# Altium schematic sheet ADDITIONAL.SchDoc
size 381 x 241 mm; SheetNumber: 4; SheetTotal: 4
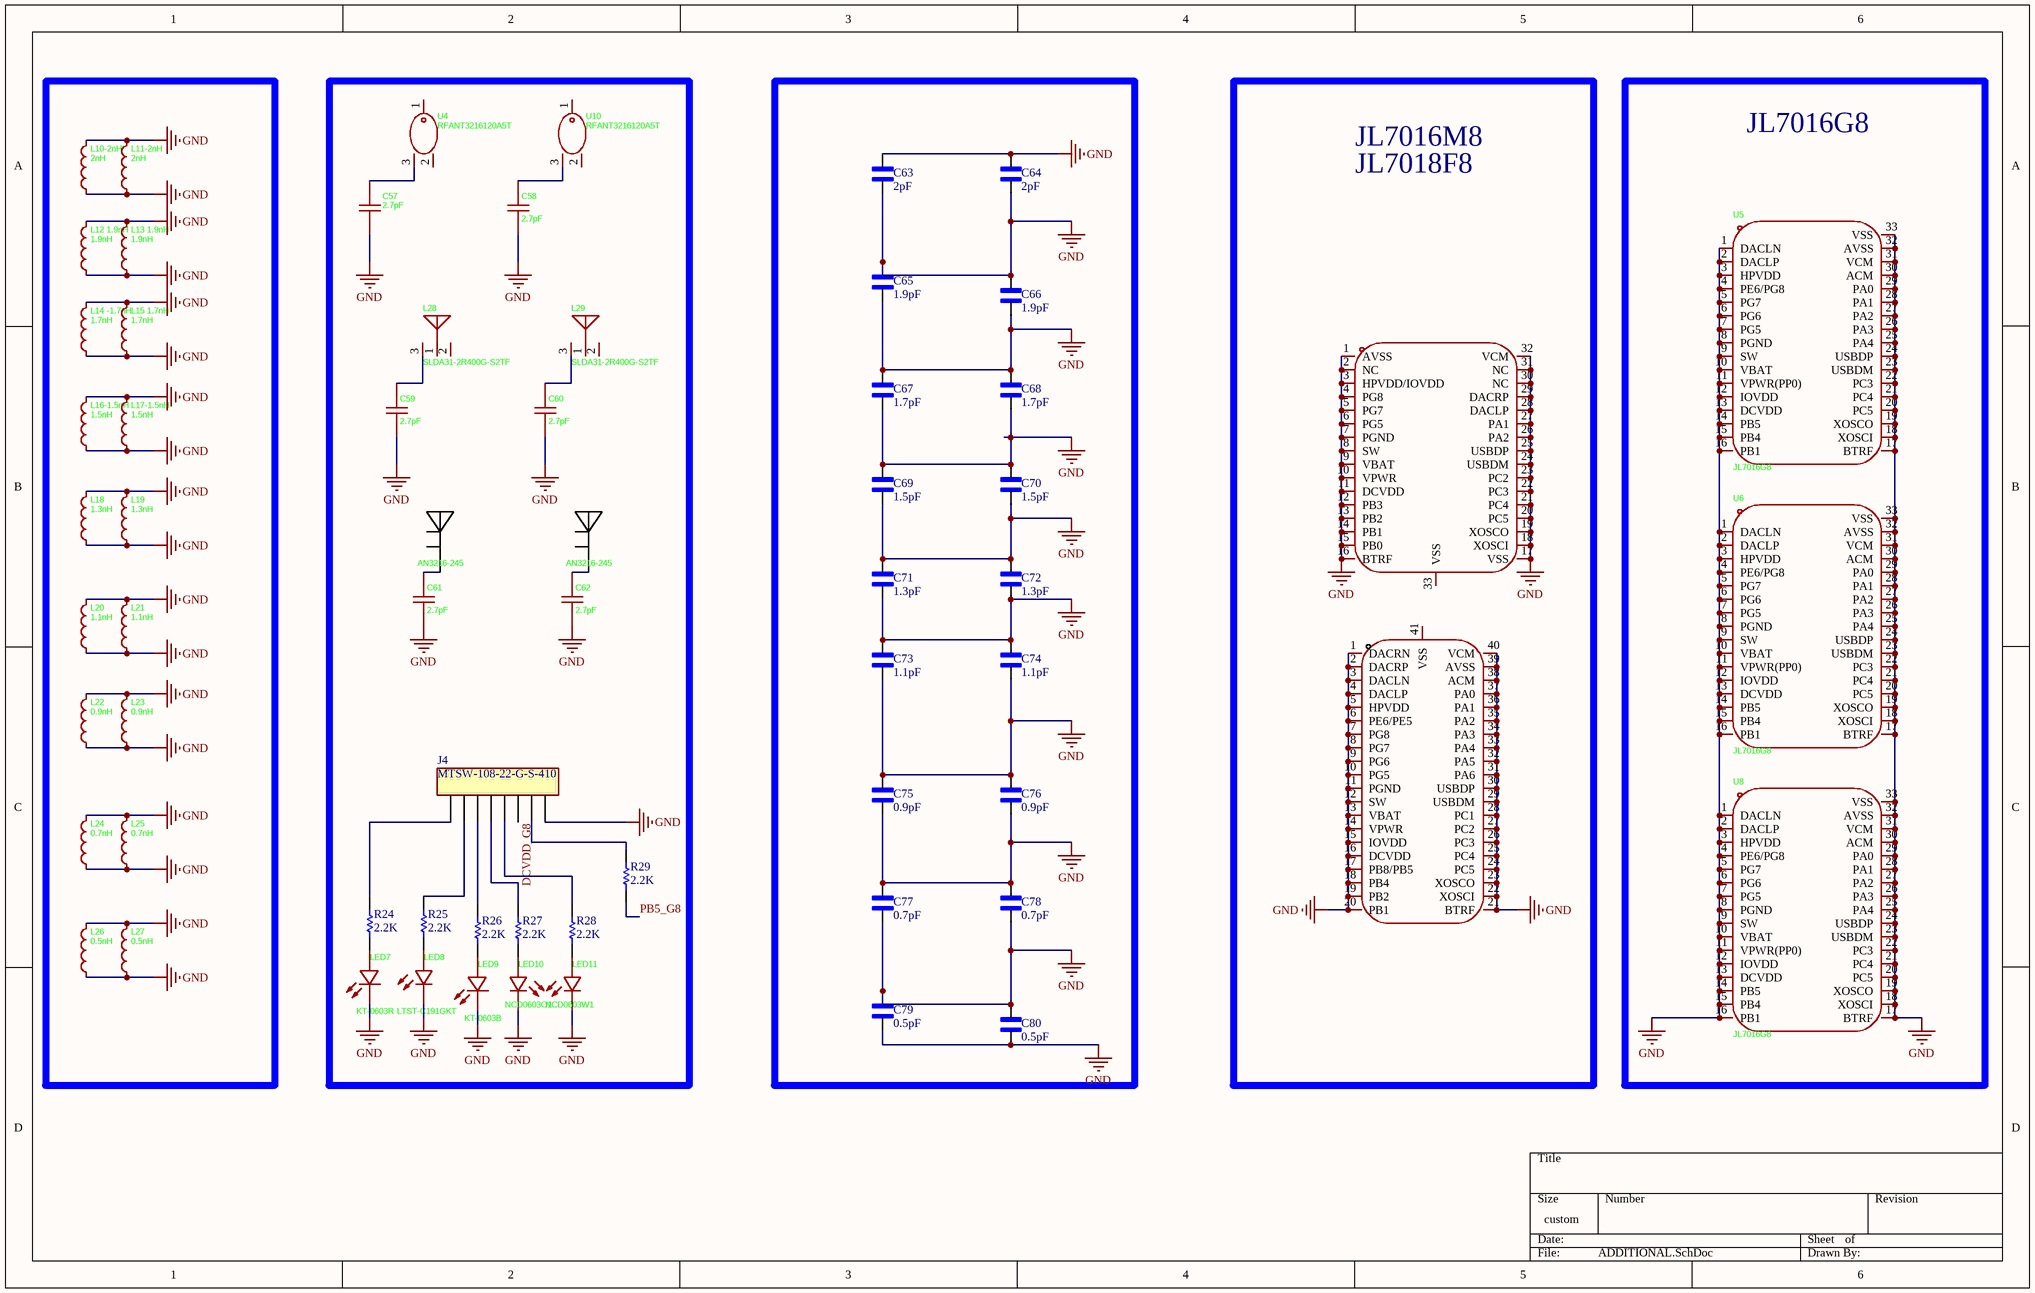
[diagram p0: ADDITIONAL.SchDoc]

## Parts
ANT4  AN3216-245  [CUSTOME ANTEENA]
ANT5  AN3216-245  [CUSTOME ANTEENA]
C57  2.7pF  [C0603]
C58  2.7pF  [C0603]
C59  2.7pF  [C0603]
C60  2.7pF  [C0603]
C61  2.7pF  [C0603]
C62  2.7pF  [C0603]
C63  2pF  [C0402]
C64  2pF  [C0402]
C65  1.9pF  [C0402]
C66  1.9pF  [C0402]
C67  1.7pF  [C0402]
C68  1.7pF  [C0402]
C69  1.5pF  [C0402]
C70  1.5pF  [C0402]
C71  1.3pF  [C0402]
C72  1.3pF  [C0402]
C73  1.1pF  [C0402]
C74  1.1pF  [C0402]
C75  0.9pF  [C0402]
C76  0.9pF  [C0402]
C77  0.7pF  [C0402]
C78  0.7pF  [C0402]
C79  0.5pF  [C0402]
C80  0.5pF  [C0402]
J4  MTSW-108-22-G-S-410  [SAMTEC_MTSW-108-22-G-S-410]
L10-2nH  2nH  [L0603]
L11-2nH  2nH  [L0603]
L12_1.9nH  1.9nH  [L0603]
L13_1.9nH  1.9nH  [L0603]
L14_-1.7nH  1.7nH  [L0603]
L15_1.7nH  1.7nH  [L0603]
L16-1.5nH  1.5nH  [L0603]
L17-1.5nH  1.5nH  [L0603]
L18  1.3nH  [L0603]
L19  1.3nH  [L0603]
L20  1.1nH  [L0603]
L21  1.1nH  [L0603]
L22  0.9nH  [L0603]
L23  0.9nH  [L0603]
L24  0.7nH  [L0603]
L25  0.7nH  [L0603]
L26  0.5nH  [L0603]
L27  0.5nH  [L0603]
L28  SLDA31-2R400G-S2TF  [CUSTOME ANTEENA]
L29  SLDA31-2R400G-S2TF  [CUSTOME ANTEENA]
LED7  KT-0603R  [LED0603-RD]
LED8  LTST-C191GKT  [LED0603-R-RD_GREEN]
LED9  KT-0603B  [LED0603-RD]
LED10  NCD0603O1  [LED0603-RD]
LED11  NCD0603W1  [LED0603-RD]
R24  value 2.2K  [R0603]  (hidden comment: RES_2.2K)
R25  value 2.2K  [R0603]  (hidden comment: RES_2.2K)
R26  value 2.2K  [R0603]  (hidden comment: RES_2.2K)
R27  value 2.2K  [R0603]  (hidden comment: RES_2.2K)
R28  value 2.2K  [R0603]  (hidden comment: RES_2.2K)
R29  value 2.2K  [R0603]  (hidden comment: RES_2.2K)
U4  RFANT3216120A5T  [CUSTOME ANTEENA]
U5  JL7016G8  [QFN-32_L4.0-W4.0-P0.40-TL-EP2.7]
U6  JL7016G8  [QFN-32_L4.0-W4.0-P0.40-TL-EP2.7]
U7  JL7016M8  [QFN-32_L4.0-W4.0-P0.40-TL-EP2.7_1]  (value not drawn)
U8  JL7016G8  [QFN-32_L4.0-W4.0-P0.40-TL-EP2.7]
U9  JL7018F8  [QFN-40_L5.0-W5.0-P0.40-TL-EP3.6]  (value not drawn)
U10  RFANT3216120A5T  [CUSTOME ANTEENA]

## Blocks framed on the sheet
JL7016G8: U5 U6 U8

## Nets
GND: C57.1 C58.1 C59.1 C60.1 C61.1 C62.1 C63.1 C63.2 C64.1 C64.2 C65.1 C65.2 C66.1 C66.2 C67.1 C67.2 C68.1 C68.2 C69.1 C69.2 C70.1 C70.2 C71.1 C71.2 C72.1 C72.2 C73.1 C73.2 C74.1 C74.2 C75.1 C75.2 C76.1 C76.2 C77.1 C77.2 C78.1 C78.2 C79.1 C79.2 C80.1 C80.2 J4.08 L10-2nH.1 L10-2nH.2 L11-2nH.1 L11-2nH.2 L12_1.9nH.1 L12_1.9nH.2 L13_1.9nH.1 L13_1.9nH.2 L14_-1.7nH.1 L14_-1.7nH.2 L15_1.7nH.1 L15_1.7nH.2 L16-1.5nH.1 L16-1.5nH.2 L17-1.5nH.1 L17-1.5nH.2 L18.1 L18.2 L19.1 L19.2 L20.1 L20.2 L21.1 L21.2 L22.1 L22.2 L23.1 L23.2 L24.1 L24.2 L25.1 L25.2 L26.1 L26.2 L27.1 L27.2 LED7.1(K) LED8.2(C) LED9.1(K) LED10.1(K) LED11.1(-) U5.1(DACLN) U5.2(DACLP) U5.3(HPVDD) U5.4(PE6/PG8) U5.5(PG7) U5.6(PG6) U5.7(PG5) U5.8(PGND) U5.9(SW) U5.10(VBAT) U5.11(VPWR(PP0)) U5.12(IOVDD) U5.13(DCVDD) U5.14(PB5) U5.15(PB4) U5.16(PB1) U5.17(BTRF) U5.18(XOSCI) U5.19(XOSCO) U5.20(PC5) U5.21(PC4) U5.22(PC3) U5.23(USBDM) U5.24(USBDP) U5.25(PA4) U5.26(PA3) U5.27(PA2) U5.28(PA1) U5.29(PA0) U5.30(ACM) U5.31(VCM) U5.32(AVSS) U5.33(VSS) U6.1(DACLN) U6.2(DACLP) U6.3(HPVDD) U6.4(PE6/PG8) U6.5(PG7) U6.6(PG6) U6.7(PG5) U6.8(PGND) U6.9(SW) U6.10(VBAT) U6.11(VPWR(PP0)) U6.12(IOVDD) U6.13(DCVDD) U6.14(PB5) U6.15(PB4) U6.16(PB1) U6.17(BTRF) U6.18(XOSCI) U6.19(XOSCO) U6.20(PC5) U6.21(PC4) U6.22(PC3) U6.23(USBDM) U6.24(USBDP) U6.25(PA4) U6.26(PA3) U6.27(PA2) U6.28(PA1) U6.29(PA0) U6.30(ACM) U6.31(VCM) U6.32(AVSS) U6.33(VSS) U7.1(AVSS) U7.2(NC) U7.3(HPVDD/IOVDD) U7.4(PG8) U7.5(PG7) U7.6(PG5) U7.7(PGND) U7.8(SW) U7.9(VBAT) U7.10(VPWR) U7.11(DCVDD) U7.12(PB3) U7.13(PB2) U7.14(PB1) U7.15(PB0) U7.16(BTRF) U7.17(VSS) U7.18(XOSCI) U7.19(XOSCO) U7.20(PC5) U7.21(PC4) U7.22(PC3) U7.23(PC2) U7.24(USBDM) U7.25(USBDP) U7.26(PA2) U7.27(PA1) U7.28(DACLP) U7.29(DACRP) U7.30(NC) U7.31(NC) U7.32(VCM) U8.1(DACLN) U8.2(DACLP) U8.3(HPVDD) U8.4(PE6/PG8) U8.5(PG7) U8.6(PG6) U8.7(PG5) U8.8(PGND) U8.9(SW) U8.10(VBAT) U8.11(VPWR(PP0)) U8.12(IOVDD) U8.13(DCVDD) U8.14(PB5) U8.15(PB4) U8.16(PB1) U8.17(BTRF) U8.18(XOSCI) U8.19(XOSCO) U8.20(PC5) U8.21(PC4) U8.22(PC3) U8.23(USBDM) U8.24(USBDP) U8.25(PA4) U8.26(PA3) U8.27(PA2) U8.28(PA1) U8.29(PA0) U8.30(ACM) U8.31(VCM) U8.32(AVSS) U8.33(VSS) U9.1(DACRN) U9.2(DACRP) U9.3(DACLN) U9.4(DACLP) U9.5(HPVDD) U9.6(PE6/PE5) U9.7(PG8) U9.8(PG7) U9.9(PG6) U9.10(PG5) U9.11(PGND) U9.12(SW) U9.13(VBAT) U9.14(VPWR) U9.15(IOVDD) U9.16(DCVDD) U9.17(PB8/PB5) U9.18(PB4) U9.19(PB2) U9.20(PB1) U9.21(BTRF) U9.22(XOSCI) U9.23(XOSCO) U9.24(PC5) U9.25(PC4) U9.26(PC3) U9.27(PC2) U9.28(PC1) U9.29(USBDM) U9.30(USBDP) U9.31(PA6) U9.32(PA5) U9.33(PA4) U9.34(PA3) U9.35(PA2) U9.36(PA1) U9.37(PA0) U9.38(ACM) U9.39(AVSS) U9.40(VCM)
DCVDD_G8: J4.06
PB5_G8: R29.1
NetANT4_3: ANT4.3 C61.2
NetANT5_3: ANT5.3 C62.2
NetC57_2: C57.2 U4.3
NetC58_2: C58.2 U10.3
NetC59_2: C59.2 L28.3
NetC60_2: C60.2 L29.3
NetJ4_01: J4.01 R24.2
NetJ4_02: J4.02 R25.2
NetJ4_03: J4.03 R26.2
NetJ4_04: J4.04 R27.2
NetJ4_05: J4.05 R28.2
NetJ4_07: J4.07 R29.2
NetLED7_2: LED7.2(A) R24.1
NetLED8_1: LED8.1(A) R25.1
NetLED9_2: LED9.2(A) R26.1
NetLED10_2: LED10.2(A) R27.1
NetLED11_2: LED11.2(+) R28.1

Not connected (* = marked no-connect by the designer): ANT4 1 2; ANT5 1 2; L28 1 2(NC); L29 1 2(NC); U4 1 2; U7 33(VSS); U9 41(VSS); U10 1 2

## Notes on the sheet
- JL7016M8
- JL7018F8

## Library data of the parts
ANT4 ANT5 = AN3216-245: Manufacturer: Rainsun(霖昱微); Add into BOM: yes; Frequency(Center/Band): 2.45GHz; Bandwidth: 100MHz; Peak Gain: 0.5dBi; Impedance: 50Ω; Power: 1W; VSWR: 2.5; Symbol: AN3216-245; Device: AN3216-245; LCSC Part Name: AN3216-245; Supplier Part: C2916136; Manufacturer Part: AN3216-245; Supplier Footprint: 1206; JLCPCB Part Class: Extended Part; Datasheet: https://item.szlcsc.com/datasheet/AN3216-245/3211390.html; Supplier: LCSC; Convert to PCB: yes; Operating Temperature: -40℃~+85℃; Length: 3.2mm; Width: 1.6mm; Height: 1.3mm
C57-C62 = 0603CG2R7C500NT: Manufacturer: FH(风华); Add into BOM: yes; Voltage Rating: 50V; Temperature Coefficient: C0G; Symbol: 0603CG2R7C500NT; Device: 0603CG2R7C500NT; LCSC Part Name: ±0.25pF 2.7pF 50V; Supplier Part: C95180; Manufacturer Part: 0603CG2R7C500NT; Supplier Footprint: 0603; JLCPCB Part Class: Extended Part; Datasheet: https://item.szlcsc.com/datasheet/0603CG2R7C500NT/96381.html; Supplier: LCSC; Convert to PCB: yes; Value: 2.7pF
C63 C64 = CAP 2pF: 2pF 50V C0G 0402 Multilayer Ceramic Capacitors MLCC - SMD/SMT ROHS; Manufacturer: Murata Electronics; MFR.Part #: GJM1555C1H2R0WB01D; JLCPCB Part #: C88885; Package: 0402; Value: 2pF
C65 C66 = CAP 1.9pF: 1.9pF 50V C0G 0402 Multilayer Ceramic Capacitors MLCC - SMD/SMT ROHS; Manufacturer: Murata Electronics; MFR.Part #: GJM1555C1H1R9BB01D; JLCPCB Part #: C161314; Package: 0402; Value: 1.9pF
C67 C68 = CAP 1.7pF: 1.7pF 50V C0G 0402 Multilayer Ceramic Capacitors MLCC - SMD/SMT ROHS; Manufacturer: Murata Electronics; MFR.Part #: GJM1555C1H1R7WB01D; JLCPCB Part #: C471379; Package: 0402; Value: 1.7pF
C69 C70 = CAP 1.5pF: 1.5pF 50V C0G 0402 Multilayer Ceramic Capacitors MLCC - SMD/SMT ROHS; Manufacturer: Murata Electronics; MFR.Part #: GJM1555C1H1R5BB01D; JLCPCB Part #: C76900; Package: 0402; Value: 1.5pF
C71 C72 = CAP 1.3pF: 1.3pF 50V C0G 0402 Multilayer Ceramic Capacitors MLCC - SMD/SMT ROHS; Manufacturer: Murata Electronics; MFR.Part #: GJM1555C1H1R3WB01D; JLCPCB Part #: C88880; Package: 0402; Value: 1.3pF
C73 C74 = CAP 1.1pF: 1.1pF 50V C0G 0402 Multilayer Ceramic Capacitors MLCC - SMD/SMT ROHS; Manufacturer: Murata Electronics; MFR.Part #: GJM1555C1H1R1WB01D; JLCPCB Part #: C88879; Package: 0402; Value: 1.1pF
C75 C76 = CAP 0.9pF: 0.9pF 50V C0G 0402 Multilayer Ceramic Capacitors MLCC - SMD/SMT ROHS; Manufacturer: FH (Guangdong Fenghua Advanced Tech); MFR.Part #: 0402CG0R9B500NT; JLCPCB Part #: C6563238; Package: 0402; Value: 0.9pF
C77 C78 = CAP 0.7pF: 0.7pF 50V C0G 0402 Multilayer Ceramic Capacitors MLCC - SMD/SMT ROHS; Manufacturer: FH (Guangdong Fenghua Advanced Tech); MFR.Part #: 0402CG0R7C500NT; JLCPCB Part #: C284999; Package: 0402; Value: 0.7pF
C79 C80 = CAP 0.5pF: 0.5pF 50V C0G 0402 Multilayer Ceramic Capacitors MLCC - SMD/SMT ROHS; Manufacturer: FH (Guangdong Fenghua Advanced Tech); MFR.Part #: 0402CG0R5C500NT; JLCPCB Part #: C1544; Package: 0402; Value: 0.5pF
L10-2nH L11-2nH = 2nH: 2nH Multilayer inductor 0603 Inductors (SMD) ROHS; Manufacturer: Murata Electronics; Manufacturer Part: SDCL1608C2N0STDF; Symbol: DFE18SAN1R0ME0L; Add into BOM: yes; Tolerance: ±20%; Current Rating: 1.6A; DC Resistance(DCR): 144mΩ; Device: DFE18SAN1R0ME0L; LCSC Part Name: 1uH ±20%; Supplier Part: C370234; Supplier Footprint: 0603; JLCPCB Part Class: Extended Part; Datasheet: https://atta.szlcsc.com/upload/public/pdf/source/20210601/1EEB72040C737E24AB5C3900F417DA4B.pdf; Supplier: LCSC; Convert to PCB: yes; Value: 2nH; Current - Saturation (Isat): -; Q @ Frequency: -; Frequency - Self Resonant: -; Ratings: -
L12_1.9nH L13_1.9nH = 1.9nH: 1.04A 1.9nH 11.3MHz 16@250MHz 70mΩ 0402 Inductors (SMD) ROHS; Manufacturer: Chilisin Elec; Manufacturer Part: CS0402-1N9B-S; Symbol: DFE18SAN1R0ME0L; Add into BOM: yes; Tolerance: ±20%; Current Rating: 1.6A; DC Resistance(DCR): 144mΩ; Device: DFE18SAN1R0ME0L; LCSC Part Name: 1uH ±20%; Supplier Part: C142187; Supplier Footprint: 0603; JLCPCB Part Class: Extended Part; Datasheet: https://atta.szlcsc.com/upload/public/pdf/source/20210601/1EEB72040C737E24AB5C3900F417DA4B.pdf; Supplier: LCSC; Convert to PCB: yes; Value: 1.9nH; Current - Saturation (Isat): -; Q @ Frequency: -; Frequency - Self Resonant: -; Ratings: -
L14_-1.7nH L15_1.7nH = 1.7nH: 1.7nH 100mΩ 640mA 0402 Inductors (SMD) ROHS; Manufacturer: Sunlord; Manufacturer Part: MWSD1005C1N7STM01; Symbol: DFE18SAN1R0ME0L; Add into BOM: yes; Tolerance: ±20%; Current Rating: 1.6A; DC Resistance(DCR): 144mΩ; Device: DFE18SAN1R0ME0L; LCSC Part Name: 1uH ±20%; Supplier Part: C778761; Supplier Footprint: 0603; JLCPCB Part Class: Extended Part; Datasheet: https://atta.szlcsc.com/upload/public/pdf/source/20210601/1EEB72040C737E24AB5C3900F417DA4B.pdf; Supplier: LCSC; Convert to PCB: yes; Value: 1.7nH; Current - Saturation (Isat): -; Q @ Frequency: -; Frequency - Self Resonant: -; Ratings: -
L16-1.5nH L17-1.5nH = 1.5nH: 1.5nH 100mΩ 500mA 6GHz 8@100MHz Multilayer inductor 0603 Inductors (SMD) ROHS; Manufacturer: Sunlord; Manufacturer Part: SDCL1608C1N5STDF; Symbol: DFE18SAN1R0ME0L; Add into BOM: yes; Tolerance: ±20%; Current Rating: 1.6A; DC Resistance(DCR): 144mΩ; Device: DFE18SAN1R0ME0L; LCSC Part Name: 1uH ±20%; Supplier Part: C22223; Supplier Footprint: 0603; JLCPCB Part Class: Extended Part; Datasheet: https://atta.szlcsc.com/upload/public/pdf/source/20210601/1EEB72040C737E24AB5C3900F417DA4B.pdf; Supplier: LCSC; Convert to PCB: yes; Value: 1.5nH; Current - Saturation (Isat): -; Q @ Frequency: -; Frequency - Self Resonant: -; Ratings: -
L18 L19 = 1.3nH: 1.3nH 1A 40mΩ 7@100MHz 8GHz Multilayer inductor 0402 Inductors (SMD) ROHS; Manufacturer: TDK; Manufacturer Part: MLG1005S1N3BT000; Symbol: DFE18SAN1R0ME0L; Add into BOM: yes; Tolerance: ±20%; Current Rating: 1.6A; DC Resistance(DCR): 144mΩ; Device: DFE18SAN1R0ME0L; LCSC Part Name: 1uH ±20%; Supplier Part: C76767; Supplier Footprint: 0603; JLCPCB Part Class: Extended Part; Datasheet: https://atta.szlcsc.com/upload/public/pdf/source/20210601/1EEB72040C737E24AB5C3900F417DA4B.pdf; Supplier: LCSC; Convert to PCB: yes; Value: 1.3nH; Current - Saturation (Isat): -; Q @ Frequency: -; Frequency - Self Resonant: -; Ratings: -
L20 L21 = 1.1nH: 1.1nH 10GHz 1A 30mΩ 7@100MHz AEC-Q200 Multilayer inductor 0402 Inductors (SMD) ROHS; Manufacturer: TDK; Manufacturer Part: MLG1005S1N1BTD25; Symbol: DFE18SAN1R0ME0L; Add into BOM: yes; Tolerance: ±20%; Current Rating: 1.6A; DC Resistance(DCR): 144mΩ; Device: DFE18SAN1R0ME0L; LCSC Part Name: 1uH ±20%; Supplier Part: C404613; Supplier Footprint: 0603; JLCPCB Part Class: Extended Part; Datasheet: https://atta.szlcsc.com/upload/public/pdf/source/20210601/1EEB72040C737E24AB5C3900F417DA4B.pdf; Supplier: LCSC; Convert to PCB: yes; Value: 1.1nH; Current - Saturation (Isat): -; Q @ Frequency: -; Frequency - Self Resonant: -; Ratings: -
L22 L23 = 0.9nH: 0.9nH 100mΩ 10GHz 1A Multilayer inductor 0402 Inductors (SMD) ROHS; Manufacturer: TDK; Manufacturer Part: MLG1005S0N9BT000; Symbol: DFE18SAN1R0ME0L; Add into BOM: yes; Tolerance: ±20%; Current Rating: 1.6A; DC Resistance(DCR): 144mΩ; Device: DFE18SAN1R0ME0L; LCSC Part Name: 1uH ±20%; Supplier Part: C275263; Supplier Footprint: 0603; JLCPCB Part Class: Extended Part; Datasheet: https://atta.szlcsc.com/upload/public/pdf/source/20210601/1EEB72040C737E24AB5C3900F417DA4B.pdf; Supplier: LCSC; Convert to PCB: yes; Value: 0.9nH; Current - Saturation (Isat): -; Q @ Frequency: -; Frequency - Self Resonant: -; Ratings: -
L24 L25 = 0.7nH: 0.7nH 100mΩ 10GHz 1A Multilayer inductor 0402 Inductors (SMD) ROHS; Manufacturer: TDK; Manufacturer Part: MLG1005S0N7BT000; Symbol: DFE18SAN1R0ME0L; Add into BOM: yes; Tolerance: ±20%; Current Rating: 1.6A; DC Resistance(DCR): 144mΩ; Device: DFE18SAN1R0ME0L; LCSC Part Name: 1uH ±20%; Supplier Part: C275262; Supplier Footprint: 0603; JLCPCB Part Class: Extended Part; Datasheet: https://atta.szlcsc.com/upload/public/pdf/source/20210601/1EEB72040C737E24AB5C3900F417DA4B.pdf; Supplier: LCSC; Convert to PCB: yes; Value: 0.7nH; Current - Saturation (Isat): -; Q @ Frequency: -; Frequency - Self Resonant: -; Ratings: -
L26 L27 = 0.5nH: 0.5nH 100mΩ 10GHz 1A Multilayer inductor 0402 Inductors (SMD) ROHS; Manufacturer: TDK; Manufacturer Part: MLG1005S0N5BT000; Symbol: DFE18SAN1R0ME0L; Add into BOM: yes; Tolerance: ±20%; Current Rating: 1.6A; DC Resistance(DCR): 144mΩ; Device: DFE18SAN1R0ME0L; LCSC Part Name: 1uH ±20%; Supplier Part: C87528; Supplier Footprint: 0603; JLCPCB Part Class: Extended Part; Datasheet: https://atta.szlcsc.com/upload/public/pdf/source/20210601/1EEB72040C737E24AB5C3900F417DA4B.pdf; Supplier: LCSC; Convert to PCB: yes; Value: 0.5nH; Current - Saturation (Isat): -; Q @ Frequency: -; Frequency - Self Resonant: -; Ratings: -
L28 L29 = SLDA31-2R400G-S2TF: Manufacturer: Sunlord(顺络); Add into BOM: yes; Frequency(Center/Band): 2.4GHz; Bandwidth: 100MHz; Peak Gain: 2.5dBi; Impedance: 50Ω; Power: 3W; VSWR: 2; Symbol: SLDA31-2R400G-S2TF; Device: SLDA31-2R400G-S2TF; LCSC Part Name: 叠层片式天线2400MHz; Supplier Part: C370395; Manufacturer Part: SLDA31-2R400G-S2TF; Supplier Footprint: 1206; JLCPCB Part Class: Extended Part; Datasheet: https://item.szlcsc.com/datasheet/SLDA31-2R400G-S2TF/344146.html; Supplier: LCSC; Convert to PCB: yes; Antenna Type: -; Operating Temperature: -40℃~+85℃; Length: 3.2mm; Width: 1.6mm
LED7 = KT-0603R: Manufacturer: KENTO; Add into BOM: yes; Emitted Color: Red; Symbol: KT-0603R; Device: KT-0603R; LCSC Part Name: 0603 红灯 高亮; Supplier Part: C2286; Manufacturer Part: KT-0603R; Supplier Footprint: 0603; JLCPCB Part Class: Basic Part; Datasheet: https://atta.szlcsc.com/upload/public/pdf/source/20160616/1466072038404.pdf; Supplier: LCSC; Convert to PCB: yes; Power Dissipation: -; Forward Current: -; Dominant Wavelength: -; Peak Wavelength: -; Diode Configuration: -; Lens Color: -; Color Temperature: -; Viewing Angle: -; Mounting Sytle: -; Operating Temperature: -40℃~+85℃
LED8 = LTST-C191GKT: -55℃~+85℃ 100mW 12mcd 130° 2.1V 20mA 565nm 569nm Discrete Diode Green Water Clear 0603 LED Indication - Discrete ROHS; Manufacturer: LITEON(光宝); Add into BOM: yes; Symbol: LTST-C191GKT; Device: LTST-C191GKT; LCSC Part Name: LTST-C191GKT; Supplier Part: C99289; Manufacturer Part: LTST-C191GKT; Supplier Footprint: 0603; JLCPCB Part Class: Extended Part; Datasheet: https://item.szlcsc.com/datasheet/LTST-C191GKT/100502.html; Supplier: LCSC; Convert to PCB: yes; Illumination Color: -; Voltage - Forward(Vf): 2.1V; Power(Watts): 100mW; Forward Current: 20mA; Wavelength - Dominant: 569nm; Peak Wavelength: 565nm; Diode Configuration: -; Lens Color: Water Clear; Color Temperature: -; Luminous Intensity: 12mcd; Viewing Angle: 130°; Mounting Style: -; Operating Temperature: -55℃~+85℃
LED9 = KT-0603B: Manufacturer: KENTO; Symbol: Blue light 0603; Add into BOM: yes; Illumination Color: Blue; Voltage - Forward(Vf): 3.1V; Power(Watts): 100mW; Forward Current: 5mA; Wavelength - Dominant: 460nm~475nm; Peak Wavelength: 469nm; Lens Color: Water Clear; Luminous Intensity: 175mcd; Viewing Angle: 120°; Device: KT-0603B; LCSC Part Name: 0603 蓝灯 高亮; Supplier Part: C2288; Manufacturer Part: KT-0603B; Supplier Footprint: 0603; JLCPCB Part Class: Extended Part; Datasheet: https://item.szlcsc.com/datasheet/KT-0603B/2661.html; Supplier: LCSC; Convert to PCB: yes; Diode Configuration: -; Color Temperature: -; Mounting Style: -; Operating Temperature: -
LED10 = NCD0603O1: Manufacturer: 国星光电; Symbol: FC-D1608HOK-600H; Add into BOM: yes; Emitted Color: Orange; Forward Voltage (VF): 1.6V~2.6V; Power Dissipation: 65mW; Forward Current: 20mA; Dominant Wavelength: 600nm~610nm; Lens Color: 无色透明透镜; Luminous Intensity: 80mcd~220mcd; Viewing Angle: 130°; Device: NCD0603O1; LCSC Part Name: NCD0603O1; Supplier Part: C84269; Manufacturer Part: NCD0603O1; Supplier Footprint: 0603; JLCPCB Part Class: Extended Part; Datasheet: https://atta.szlcsc.com/upload/public/pdf/source/20200820/C84269_76D7AD616B091E5B61CAF71BD9DDF26F.pdf; Supplier: LCSC; Convert to PCB: yes; Operating Temperature: -30℃~+85℃
LED11 = NCD0603W1: Manufacturer: 国星光电; Add into BOM: yes; Illumination Color: White; Voltage - Forward(Vf): 2.6V~3.6V; Power(Watts): 72mW; Forward Current: 20mA; Luminous Intensity: 300mcd; Viewing Angle: 130°; Symbol: NCD0603W1; Device: NCD0603W1; LCSC Part Name: 片式发光二极管; Supplier Part: C84265; Manufacturer Part: NCD0603W1; Supplier Footprint: 0603; JLCPCB Part Class: Extended Part; Datasheet: https://item.szlcsc.com/datasheet/NCD0603W1/85434.html; Supplier: LCSC; Convert to PCB: yes; Lens Color: -; Operating Temperature: -30℃~+85℃
R24-R29 = RES_2.2K: -55℃~+155℃ 33Ω 50V 62.5mW Thick Film Resistor ±100ppm/℃ ±5% 0402 Chip Resistor - Surface Mount ROHS; Manufacturer: YAGEO; MFR.Part #: RC0402JR-0733RL; JLCPCB Part #: C137880; Package: 0402
U4 U10 = RFANT3216120A5T: Manufacturer: Walsin(华新科); Add into BOM: yes; Antenna Type: Chip Antenna; Frequency(Center/Band): 2.4GHz; Bandwidth: 100MHz; Peak Gain: 2dBi; VSWR: 2; Symbol: RFANT3216120A5T; Device: RFANT3216120A5T; LCSC Part Name: 2.4GHz ISM频段工作频率的多层陶瓷天线; Supplier Part: C127629; Manufacturer Part: RFANT3216120A5T; Supplier Footprint: 1206; JLCPCB Part Class: Extended Part; Datasheet: https://item.szlcsc.com/datasheet/RFANT3216120A5T/138912.html; Supplier: LCSC; Convert to PCB: yes; Impedance: -; Power: -; Operating Temperature: -40℃~+85℃; Diameter (φD): 1.55mm; Length: 3.2mm; Width: 1.6mm; Height: 1.2mm
U5 U6 U8 = JL7016G8: Manufacturer: JL(杰理); Add into BOM: yes; Symbol: JL7016G8; Device: JL7016G8; LCSC Part Name: JL7016G8; Supplier Part: C22440782; Manufacturer Part: JL7016G8; Supplier Footprint: QFN-32(4x4); JLCPCB Part Class: Extended Part; Datasheet: https://atta.szlcsc.com/upload/public/pdf/source/20240530/E944A80303950A6147680AC436B49373.pdf; Supplier: LCSC; Convert to PCB: yes
U7 = JL7016M8: Manufacturer: JL(杰理); Add into BOM: yes; Symbol: JL7016M8; Device: JL7016M8; LCSC Part Name: JL7016M8; Supplier Part: C22440800; Manufacturer Part: JL7016M8; Supplier Footprint: QFN-32(4x4); JLCPCB Part Class: Extended Part; Datasheet: https://item.szlcsc.com/datasheet/JL7016M8/24089791.html; Supplier: LCSC; Convert to PCB: yes
U9 = JL7018F8: Manufacturer: JL(杰理); Add into BOM: yes; Symbol: JL7018F8; Device: JL7018F8; LCSC Part Name: JL7018F8; Supplier Part: C22440784; Manufacturer Part: JL7018F8; Supplier Footprint: QFN-40(5x5); JLCPCB Part Class: Extended Part; Datasheet: https://atta.szlcsc.com/upload/public/pdf/source/20240530/C76432E100E871E73B9BDB95A008B29A.pdf; Supplier: LCSC; Convert to PCB: yes
J4 = MTSW-108-22-G-S-410: MP: MTSW-108-22-G-S-410; Price: None; Package: None; Value: *; Availability: Unavailable